# EAGLE schematic AQ32_v2 (EAGLE 7.3.0)
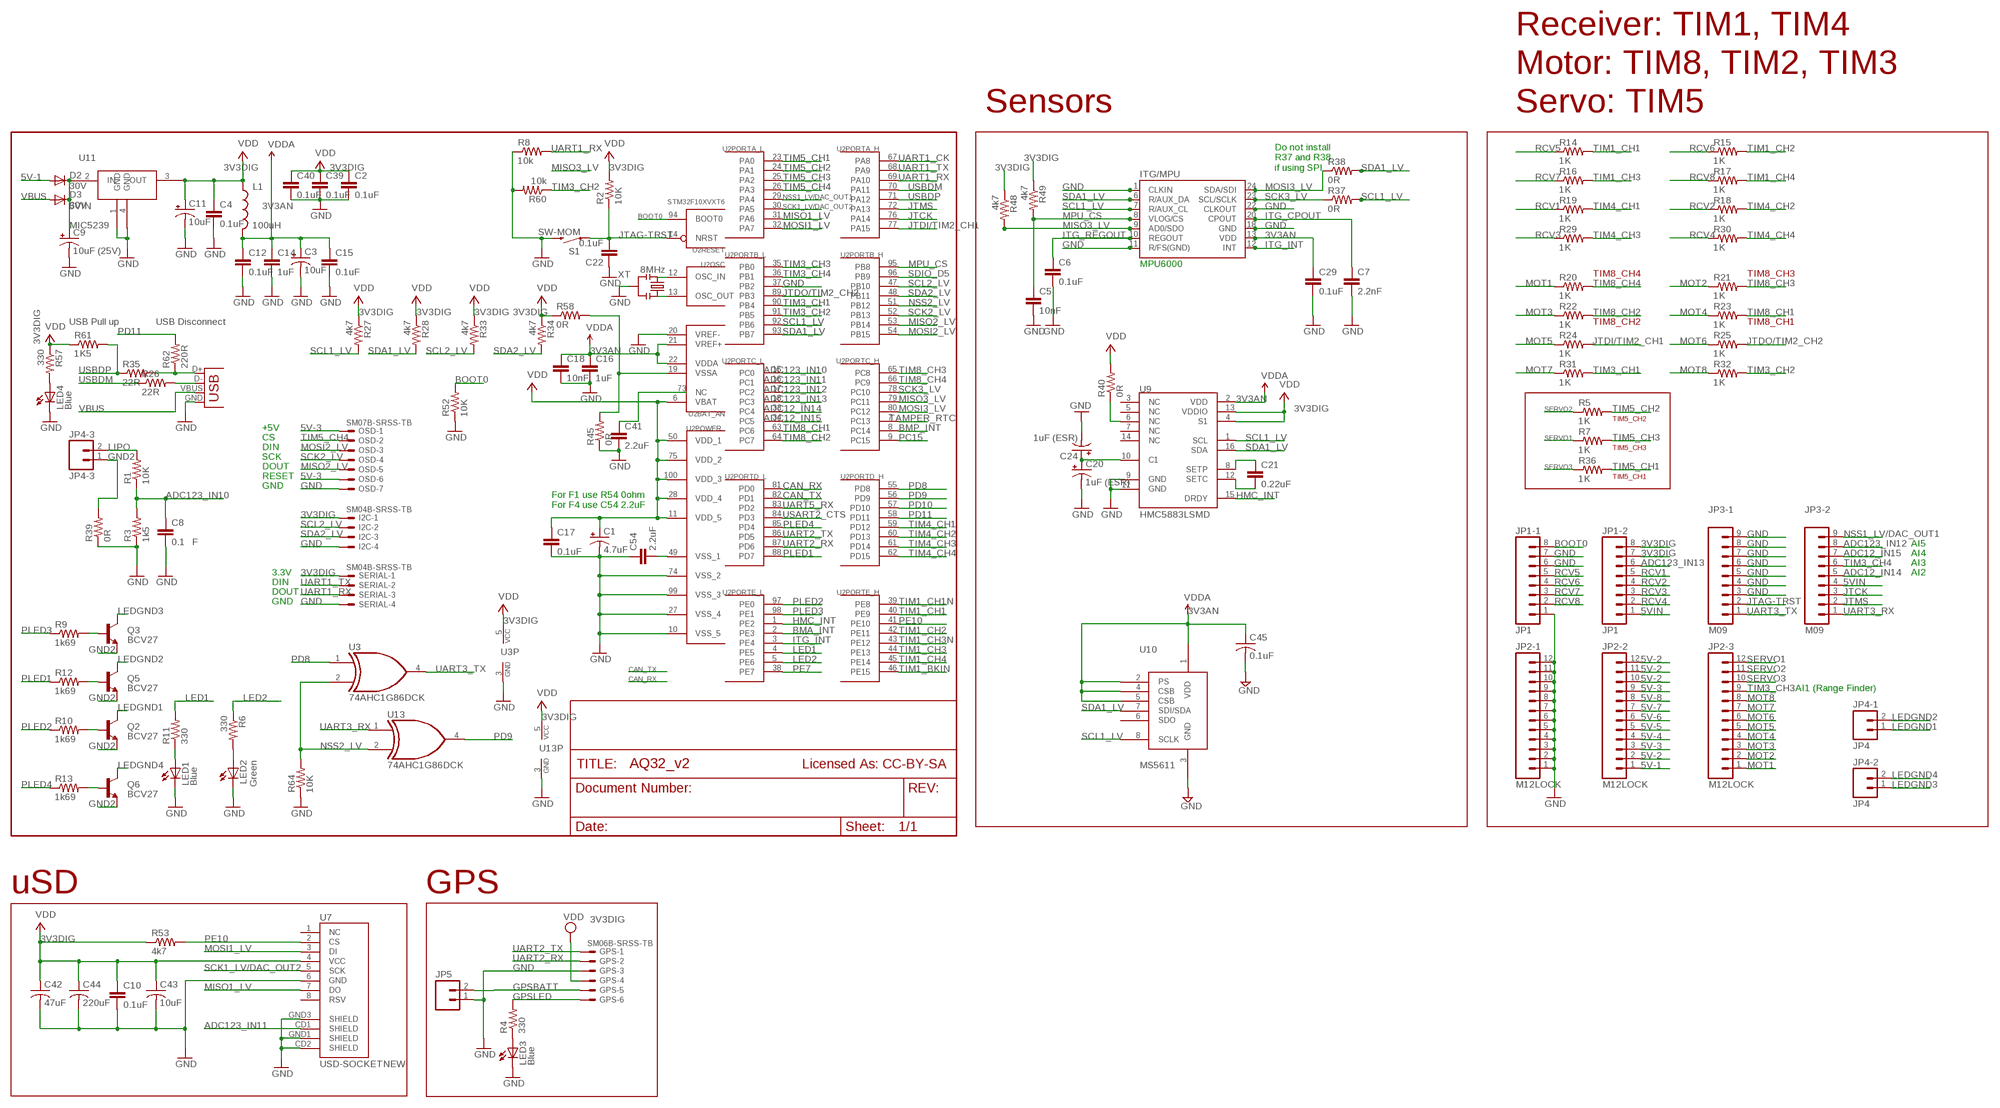
[diagram p0: schematic, sheet 1]

## Parts
C1  4.7uF  CPOL-USSMCZ  [SMC_Z]
C2  0.1uF  CAP0402  [C0402]
C3  10uF  CAP_POL1206  [EIA3216]
C4  0.1uF  CAP0402  [C0402]
C5  10nF  CAP0402  [C0402]
C6  0.1uF  CAP0402  [C0402]
C7  2.2nF  CAP0402  [C0402]
C8  0.1�F  CAP0402  [C0402]
C9  10uF (25V)  CAP_POL1206  [EIA3216]
C10  0.1uF  CAP0402  [C0402]
C11  10uF  CAP_POL1206  [EIA3216]
C12  0.1uF  CAP0402  [C0402]
C14  1uF  CAP0402  [C0402]
C15  0.1uF  CAP0402  [C0402]
C16  1uF  CAP0402  [C0402]
C17  0.1uF  CAP0402  [C0402]
C18  10nF  CAP0402  [C0402]
C20  1uF (ESR)  CPOL-USSMCZ  [SMC_Z]
C21  0.22uF  CAP0402  [C0402]
C22  0.1uF  CAP0402  [C0402]
C24  1uF (ESR)  CPOL-USSMCZ  [SMC_Z]
C29  0.1uF  CAP0402  [C0402]
C39  0.1uF  CAP0402  [C0402]
C40  0.1uF  CAP0402  [C0402]
C41  2.2uF  CAP0402  [C0402]
C42  47uF  C-USC0805  [C0805]
C43  10uF  C-USC0805  [C0805]
C44  220uF  C-USC1206  [C1206]
C45  0.1uF  C-USC0402  [C0402]
C54  2.2uF  CAP0402-CAP  [0402-CAP]
D2  30V  DIODESOD  [SOD-323]
D3  30V  DIODESOD  [SOD-323]
GPS  SM06B-SRSS-TB  [SM06B-SRSS-TB]
I2C  SM04B-SRSS-TB  [SM04B-SRSS-TB]
JP1-1  JP1  M08LOCK  [1X08_LOCK]
JP1-2  JP1  M08LOCK  [1X08_LOCK]
JP2-1  M12LOCK  [1X12_LOCK]
JP2-2  M12LOCK  [1X12_LOCK]
JP2-3  M12LOCK  [1X12_LOCK]
JP3-1  M09  [1X09]
JP3-2  M09  [1X09]
JP4-1  JP4  M02PTH  [1X02]
JP4-2  JP4  M02PTH  [1X02]
JP4-3  JP4-3  M02PTH  [1X02]
JP5  M02PTH  [1X02]
L1  100uH  INDUCTOR0805  [0805]
LED1  Blue  LED0603  [LED-0603]
LED2  Green  LED0603  [LED-0603]
LED3  Blue  LED0603  [LED-0603]
LED4  Blue  LED0603  [LED-0603]
OSD  SM07B-SRSS-TB  [SM07B-SRSS-TB]
Q2  BCV27  TRANSISTOR_NPNSOT23-3  [SOT23-3]
Q3  BCV27  TRANSISTOR_NPNSOT23-3  [SOT23-3]
Q5  BCV27  TRANSISTOR_NPNSOT23-3  [SOT23-3]
Q6  BCV27  TRANSISTOR_NPNSOT23-3  [SOT23-3]
R1  10K  RESISTOR0402  [C0402]
R2  10K  RESISTOR0402  [C0402]
R3  1k5  RESISTOR0402  [C0402]
R4  330  RESISTOR0402  [C0402]
R5  1K  RESISTOR0402  [C0402]
R6  330  RESISTOR0402  [C0402]
R7  1K  RESISTOR0402  [C0402]
R8  10k  R-US_R0402  [R0402]
R9  1k69  RESISTOR0402  [C0402]
R10  1k69  RESISTOR0402  [C0402]
R11  330  RESISTOR0402  [C0402]
R12  1k69  RESISTOR0402  [C0402]
R13  1k69  RESISTOR0402  [C0402]
R14  1K  RESISTOR0402  [C0402]
R15  1K  RESISTOR0402  [C0402]
R16  1K  RESISTOR0402  [C0402]
R17  1K  RESISTOR0402  [C0402]
R18  1K  RESISTOR0402  [C0402]
R19  1K  RESISTOR0402  [C0402]
R20  1K  RESISTOR0402  [C0402]
R21  1K  RESISTOR0402  [C0402]
R22  1K  RESISTOR0402  [C0402]
R23  1K  RESISTOR0402  [C0402]
R24  1K  RESISTOR0402  [C0402]
R25  1K  RESISTOR0402  [C0402]
R26  22R  RESISTOR0402  [C0402]
R27  4k7  RESISTOR0402  [C0402]
R28  4k7  RESISTOR0402  [C0402]
R29  1K  RESISTOR0402  [C0402]
R30  1K  RESISTOR0402  [C0402]
R31  1K  RESISTOR0402  [C0402]
R32  1K  RESISTOR0402  [C0402]
R33  4k7  RESISTOR0402  [C0402]
R34  4k7  RESISTOR0402  [C0402]
R35  22R  RESISTOR0402  [C0402]
R36  1K  RESISTOR0402  [C0402]
R37  0R  R-US_R0402  [R0402]
R38  0R  R-US_R0402  [R0402]
R39  0R  RESISTOR0402  [C0402]
R40  0R  R-US_R0402  [R0402]
R45  0R  R-US_R0402  [R0402]
R48  4k7  RESISTOR0402  [C0402]
R49  4k7  RESISTOR0402  [C0402]
R52  10K  RESISTOR0402  [C0402]
R53  4k7  RESISTOR0402  [C0402]
R57  330  RESISTOR0402  [C0402]
R58  0R  R-US_R0402  [R0402]
R60  10k  R-US_R0402  [R0402]
R61  1K5  R-US_R0402  [R0402]
R62  220R  RESISTOR0402  [C0402]
R64  10K  RESISTOR0402  [C0402]
S1  SW-MOM  SWITCH-MOMENTARY-2SMD  [TACTILE_SWITCH_SMD]
SERIAL  SM04B-SRSS-TB  [SM04B-SRSS-TB]
U1  ITG-3200  [QFN-24]
U2  STM32F10XVXT6  [TQFP100]
U3  74AHC1G86DCK  [SC70-5]
U7  USD-SOCKETNEW  [MICRO-SD-SOCKET-PP]
U9  HMC5883LSMD  [16LPCC]
U10  MS5611  [LGA08A]
U11  MIC5239  [TO-223]
U13  74AHC1G86DCK  [SC70-5]
X2  USBOLD  [USB-MINIB-OLD]
XT  8MHz  RESONATORSMD  [RESONATOR-SMD]

## Nets
3V3AN: C3.A(+) C12.1 C14.1 C15.1 C16.1 C18.1 C29.1 C45.1 L1.2 U1.13(VDD) U2.21(BAT_AN:VREF+) U2.22(BAT_AN:VDDA) U9.2(VDD) U10.1(VDD) U10.2(PS) U10.4(CSB) U10.5(CSB) ; supply symbol labelled VDDA
3V3DIG: C1.+ C2.1 C4.1 C10.1 C11.A(+) C17.1 C39.1 C40.1 C42.1 C43.1 C44.1 GPS.4 I2C.1 JP1-2.7 JP1-2.8 L1.1 R2.2 R27.1 R28.1 R33.1 R34.1 R40.2 R48.1 R49.1 R53.1 R57.1 R58.1 R61.1 SERIAL.1 U2.6(BAT_AN:VBAT) U2.11(POWER:VDD_5) U2.28(POWER:VDD_4) U2.50(POWER:VDD_1) U2.75(POWER:VDD_2) U2.100(POWER:VDD_3) U3.5(VCC) U7.4(VCC) U9.4(S1) U9.13(VDDIO) U11.3(OUT) U13.5(VCC) ; supply symbol labelled VDD
5V-1 [vcc]: D2.2(A) JP2-2.1
5V-2: JP2-2.2 JP2-2.10 JP2-2.11 JP2-2.12
5V-3: JP2-2.3 JP2-2.9 OSD.1 OSD.6
5V-4: JP2-2.4
5V-5: JP2-2.5
5V-6: JP2-2.6
5V-7: JP2-2.7
5V-8: JP2-2.8
5VIN [vcc]: C9.A(+) D2.1(C) D3.1(C) JP1-2.1 JP3-2.4 U11.2(IN)
ADC12_IN14: JP3-2.5 U2.33(PORTC_L:PC4)
ADC12_IN15: JP3-2.7 U2.34(PORTC_L:PC5)
ADC123_IN10: C8.1 R1.1 R3.2 U2.15(PORTC_L:PC0)
ADC123_IN11: U2.16(PORTC_L:PC1) U7.CD1(SHIELD)
ADC123_IN12: JP3-2.8 U2.17(PORTC_L:PC2)
ADC123_IN13: JP1-2.6 U2.18(PORTC_L:PC3)
BMA_INT: U2.2(PORTE_L:PE3)
BMP_INT: U2.8(PORTC_H:PC14)
BOOT0: JP1-1.8 R52.2 U2.94(RESET:BOOT0)
CAN_RX: U2.81(PORTD_L:PD0)
CAN_TX: U2.82(PORTD_L:PD1)
GND [vcc]: C1.- C2.2 C3.C(-) C4.2 C5.2 C6.2 C7.2 C8.2 C9.C(-) C10.2 C11.C(-) C12.2 C14.2 C15.2 C16.2 C17.2 C18.2 C20.- C22.1 C24.- C29.2 C39.2 C40.2 C41.2 C42.2 C43.2 C44.2 C45.2 C54.1 GPS.3 I2C.4 JP1-1.1 JP1-1.6 JP1-1.7 JP2-1.1 JP2-1.2 JP2-1.3 JP2-1.4 JP2-1.5 JP2-1.6 JP2-1.7 JP2-1.8 JP2-1.9 JP2-1.10 JP2-1.11 JP2-1.12 JP3-1.3 JP3-1.4 JP3-1.5 JP3-1.6 JP3-1.7 JP3-1.8 JP3-1.9 JP5.1 LED1.C LED2.C LED3.C LED4.C OSD.7 R3.1 R8.1 R39.1 R45.1 R52.1 R60.2 R64.1 S1.3 SERIAL.4 U1.1(CLKIN) U1.11(R/FS(GND)) U1.18(GND) U1.22(CLKOUT) U2.10(POWER:VSS_5) U2.20(BAT_AN:VREF-) U2.27(POWER:VSS_4) U2.37(PORTB_L:PB2) U2.74(POWER:VSS_2) U2.99(POWER:VSS_3) U3.3(GND) U7.6(GND) U7.CD2(SHIELD) U7.GND1(SHIELD) U7.GND3(SHIELD) U9.9(GND) U9.11(GND) U10.3(GND) U11.1(GND) U11.4(GND) U13.3(GND) X2.GND XT.2
GND2 [vcc]: JP4-3.1 Q2.2(E) Q3.2(E) Q5.2(E) Q6.2(E) R39.2
GPSBATT: GPS.5 JP5.2
GPSLED: GPS.6 R4.2
HMC_INT: U2.1(PORTE_L:PE2) U9.15(DRDY)
ITG_CPOUT: C7.1 U1.20(CPOUT)
ITG_INT: U1.12(INT) U2.3(PORTE_L:PE4)
ITG_REGOUT: C6.1 U1.10(REGOUT)
JTAG-TRST: C22.2 JP3-1.2 R2.1 S1.1 U2.14(RESET:NRST)
JTCK: JP3-2.3 U2.76(PORTA_H:PA14)
JTDI/TIM2_CH1: R24.2 U2.77(PORTA_H:PA15)
JTDO/TIM2_CH2: R25.2 U2.89(PORTB_L:PB3)
JTMS: JP3-2.2 U2.72(PORTA_H:PA13)
LED1: R11.2 U2.4(PORTE_L:PE5)
LED2: R6.1 U2.5(PORTE_L:PE6)
LEDGND1: JP4-1.1 Q2.3(C)
LEDGND2: JP4-1.2 Q5.3(C)
LEDGND3: JP4-2.1 Q3.3(C)
LEDGND4: JP4-2.2 Q6.3(C)
LIPO: JP4-3.2 R1.2
MISO1_LV: U2.31(PORTA_L:PA6) U7.7(DO)
MISO2_LV: OSD.5 U2.53(PORTB_H:PB14)
MISO3_LV: R48.2 U1.9(AD0/SDO) U2.79(PORTC_H:PC11)
MOSI1_LV: U2.32(PORTA_L:PA7) U7.3(DI)
MOSI2_LV: OSD.3 U2.54(PORTB_H:PB15)
MOSI3_LV: R38.1 U1.24(SDA/SDI) U2.80(PORTC_H:PC12)
MOT1: JP2-3.1 R20.1
MOT2: JP2-3.2 R21.1
MOT3: JP2-3.3 R22.1
MOT4: JP2-3.4 R23.1
MOT5: JP2-3.5 R24.1
MOT6: JP2-3.6 R25.1
MOT7: JP2-3.7 R31.1
MOT8: JP2-3.8 R32.1
MPU_CS: C5.1 R49.2 U1.8(VLOG/CS) U2.95(PORTB_H:PB8)
N$1: U2.12(OSC:OSC_IN) XT.3
N$2: U2.13(OSC:OSC_OUT) XT.1
N$3: LED3.A R4.1
N$4: R40.1 U9.6(NC)
N$7: LED2.A R6.2
N$9: Q3.1(B) R9.2
N$10: C54.2 U2.49(POWER:VSS_1)
N$11: Q2.1(B) R10.2
N$12: Q5.1(B) R12.2
N$15: LED1.A R11.1
N$23: Q6.1(B) R13.2
N$28: C41.1 U2.73(BAT_AN:NC)
N$34: LED4.A R57.2
N$36: R45.2 R58.2 U2.19(BAT_AN:VSSA)
N$41: C21.1 U9.8(SETP)
N$42: C21.2 U9.12(SETC)
N$67: C20.+ C24.+ U9.10(C1)
N$72: R35.2 R62.1 X2.D+
N$74: R26.2 X2.D-
NSS1_LV/DAC_OUT1: JP3-2.9 U2.29(PORTA_L:PA4)
NSS2_LV: R64.2 U2.51(PORTB_H:PB12) U3.2(I1) U13.2(I1)
PC15: U2.9(PORTC_H:PC15)
PD8: U2.55(PORTD_H:PD8) U3.1(I0)
PD9: U2.56(PORTD_H:PD9) U13.4(O)
PD10: U2.57(PORTD_H:PD10)
PD11: R62.2 U2.58(PORTD_H:PD11)
PE7: U2.38(PORTE_L:PE7)
PE10: R53.2 U2.41(PORTE_H:PE10) U7.2(CS)
PLED1: R12.1 U2.88(PORTD_L:PD7)
PLED2: R10.1 U2.97(PORTE_L:PE0)
PLED3: R9.1 U2.98(PORTE_L:PE1)
PLED4: R13.1 U2.85(PORTD_L:PD4)
RCV1: JP1-2.5 R19.1
RCV2: JP1-2.4 R18.1
RCV3: JP1-2.3 R29.1
RCV4: JP1-2.2 R30.1
RCV5: JP1-1.5 R14.1
RCV6: JP1-1.4 R15.1
RCV7: JP1-1.3 R16.1
RCV8: JP1-1.2 R17.1
SCK1_LV/DAC_OUT2: U2.30(PORTA_L:PA5) U7.5(SCK)
SCK2_LV: OSD.4 U2.52(PORTB_H:PB13)
SCK3_LV: R37.1 U1.23(SCL/SCLK) U2.78(PORTC_H:PC10)
SCL1_LV: R27.2 R37.2 U1.7(R/AUX_CL) U2.92(PORTB_L:PB6) U9.1(SCL) U10.8(SCLK)
SCL2_LV: I2C.2 R33.2 U2.47(PORTB_H:PB10)
SDA1_LV: R28.2 R38.2 U1.6(R/AUX_DA) U2.93(PORTB_L:PB7) U9.16(SDA) U10.7(SDI/SDA)
SDA2_LV: I2C.3 R34.2 U2.48(PORTB_H:PB11)
SDIO_D5: U2.96(PORTB_H:PB9)
SERVO1: JP2-3.12 R7.1
SERVO2: JP2-3.11 R5.1
SERVO3: JP2-3.10 R36.1
TAMPER_RTC: U2.7(PORTC_H:PC13)
TIM1_BKIN: U2.46(PORTE_H:PE15)
TIM1_CH1: R14.2 U2.40(PORTE_H:PE9)
TIM1_CH1N: U2.39(PORTE_H:PE8)
TIM1_CH2: R15.2 U2.42(PORTE_H:PE11)
TIM1_CH3: R16.2 U2.44(PORTE_H:PE13)
TIM1_CH3N: U2.43(PORTE_H:PE12)
TIM1_CH4: R17.2 U2.45(PORTE_H:PE14)
TIM3_CH1: R31.2 U2.90(PORTB_L:PB4)
TIM3_CH2: R32.2 R60.1 U2.91(PORTB_L:PB5)
TIM3_CH3: JP2-3.9 U2.35(PORTB_L:PB0)
TIM3_CH4: JP3-2.6 U2.36(PORTB_L:PB1)
TIM4_CH1: R19.2 U2.59(PORTD_H:PD12)
TIM4_CH2: R18.2 U2.60(PORTD_H:PD13)
TIM4_CH3: R29.2 U2.61(PORTD_H:PD14)
TIM4_CH4: R30.2 U2.62(PORTD_H:PD15)
TIM5_CH1: R36.2 U2.23(PORTA_L:PA0)
TIM5_CH2: R5.2 U2.24(PORTA_L:PA1)
TIM5_CH3: R7.2 U2.25(PORTA_L:PA2)
TIM5_CH4: OSD.2 U2.26(PORTA_L:PA3)
TIM8_CH1: R23.2 U2.63(PORTC_L:PC6)
TIM8_CH2: R22.2 U2.64(PORTC_L:PC7)
TIM8_CH3: R21.2 U2.65(PORTC_H:PC8)
TIM8_CH4: R20.2 U2.66(PORTC_H:PC9)
UART1_CK: U2.67(PORTA_H:PA8)
UART1_RX: R8.2 SERIAL.3 U2.69(PORTA_H:PA10)
UART1_TX: SERIAL.2 U2.68(PORTA_H:PA9)
UART2_RX: GPS.2 U2.87(PORTD_L:PD6)
UART2_TX: GPS.1 U2.86(PORTD_L:PD5)
UART3_RX: JP3-2.1 U13.1(I0)
UART3_TX: JP3-1.1 U3.4(O)
UART5_RX: U2.83(PORTD_L:PD2)
USART2_CTS: U2.84(PORTD_L:PD3)
USBDM: R26.1 U2.70(PORTA_H:PA11)
USBDP: R35.1 R61.2 U2.71(PORTA_H:PA12)
VBUS: D3.2(A) X2.VBUS
Unconnected: U7.1(NC) U7.8(RSV) U9.3(NC) U9.5(NC) U9.7(NC) U9.14(NC) U10.6(SDO)

## Notes on the sheet
- Receiver: TIM1, TIM4
- Motor: TIM8, TIM2, TIM3
- Sensors | Servo: TIM5
- Do not install
  R37 and R38
  if using SPI
- MPU6000
- TIM8_CH4 | TIM8_CH3
- USB Pull up | USB Disconnect | TIM8_CH2 | TIM8_CH1
- TIM5_CH2
- +5V
- CS
- DIN | TIM5_CH3
- SCK
- DOUT
- RESET | TIM5_CH1
- GND
- For F1 use R54 0ohm
  For F4 use C54 2.2uF
- AI5
- AI4
- AI3
- 3.3V | AI2
- DIN
- DOUT
- GND
- AI1 (Range Finder)
- Licensed As: CC-BY-SA
- uSD | GPS

## Library data of the parts
C1 C20 C24 = rcl:CPOL-US: POLARIZED CAPACITOR, American symbol
C2 C4-C8 C10 C12 C14-C18 C21 C22 C29 C39-C41 = SparkFun:CAP: Capacitor Standard 0603 ceramic capacitor, and 0.1" leaded capacitor.
C3 C9 C11 = SparkFun:CAP_POL: Capacitor Polarized These are standard SMD and PTH capacitors. Normally 10uF, 47uF, and 100uF in electrolytic and tantalum varieties. Always verify the external diameter of the through hole cap, it varies with capacity, voltage, and manufacturer. The EIA devices should be standard.
C42-C45 = rcl:C-US: CAPACITOR, American symbol
C54 = SparkFun-Capacitors:CAP: Capacitor Standard 0603 ceramic capacitor, and 0.1" leaded capacitor.
D2 D3 = SparkFun:DIODE: Diode These are standard reverse protection diodes and small signal diodes. SMA package can handle up to about 1A. SOD-323 can handle about 200mA. What the SOD-323 package when ordering, there are some mfgs out there that are 5-pin packages.
GPS = con-jst2:?M06B-SRSS-TB: Disconnectable Crimp style connector, 1.0mm pitch 6 contacts
I2C SERIAL = con-jst2:?M04B-SRSS-TB: Disconnectable Crimp style connector, 1.0mm pitch 4 contacts
JP1-1 JP1-2 = SparkFun-Connectors:M08: Header 8 Standard 8-pin 0.1" header. Use with straight break away headers (SKU : PRT-00116), right angle break away headers (PRT-00553), swiss pins (PRT-00743), machine pins (PRT-00117), and female headers (PRT-00115).
JP2-1-JP2-3 = SparkFun-Connectors:M12: Header 12 Standard 12-pin 0.1" header. Use with straight break away headers (SKU : PRT-00116), right angle break away headers (PRT-00553), swiss pins (PRT-00743), machine pins (PRT-00117), and female headers (PRT-00115).
JP3-1 JP3-2 = SparkFun-Connectors:M09: Header 9 Standard 9-pin 0.1" header. Use with straight break away headers (SKU : PRT-00116), right angle break away headers (PRT-00553), swiss pins (PRT-00743), machine pins (PRT-00117), and female headers (PRT-00115).
JP4-1-JP4-3 JP5 = SparkFun-Connectors:M02: Header 2 Standard 2-pin 0.1" header. Use with straight break away headers (SKU : PRT-00116), right angle break away headers (PRT-00553), swiss pins (PRT-00743), machine pins (PRT-00117), and female headers (PRT-00115). Molex polarized connector foot print use with SKU : PRT-08233 with associated crimp pins and housings.
L1 = SparkFun:INDUCTOR: Inductors Basic Inductor/Choke - 0603 and 1206. Footprints are not proven and vary greatly between part numbers.
LED1-LED4 = SparkFun:LED: LEDs Standard schematic elements and footprints for 5mm, 3mm, 1206, and 0603 sized LEDs. 5mm - Spark Fun Electronics SKU : COM-00529 (and others)
OSD = con-jst2:?M07B-SRSS-TB: Disconnectable Crimp style connector, 1.0mm pitch 7 contacts
Q2 Q3 Q5 Q6 = SparkFun:TRANSISTOR_NPN: Transistor NPN BJT configuration in SOT23 package. MMBT2222 is the common NPN we use. Double check BCE configuration again layout.
R1-R7 R9-R36 R39 R48 R49 R52 R53 R57 R62 R64 = SparkFun:RESISTOR: Resistor Basic schematic elements and footprints for 0603, 1206, and PTH 1/10th watt (small) resistors.
R8 R60 R61 = rcl:R-US_: RESISTOR, American symbol
R37 R38 R40 R45 R58 = resistor:R-US_: RESISTOR, American symbol
S1 = SparkFun:SWITCH-MOMENTARY-2
U1 = SparkFunMod:ITG-3200: ITG-3200 3-axis gyro, digital output, qfn24 package
U2 = stm32:STM32F10XVXT6: STM32F101/103 100 pin LQFP
U3 U13 = 74xx-little-us:74*1G86: 2-input EXCLUSIV-OR gate
U7 = SparkFun:USD-SOCKET: microSD Socket Push-push type uSD socket. Schematic element and footprint production proven. Spark Fun Electronics SKU : PRT-00127. tDoc lines correctly indicate media card edge positions when inserting (unlocked, locked, depressed).
U9 = SparkFun:HMC5883L: 3 Axis Digital Compass IC
U10 = DSP-TI:MS5611: Pressure sensor 10cm
U11 = DSP-TI:MIC5239: LOD Volt Reg
X2 = SparkFun:USB: USB Connectors USB-B-PTH is fully proven SKU : PRT-00139 USB-miniB is fully proven SKU : PRT-00587 USB-A-PCB is untested. USB-A-H is throughly reviewed, but untested. Spark Fun Electronics SKU : PRT-00437 USB-B-SMT is throughly reviewed, but untested. Needs silkscreen touching up. USB-A-S has not been used/tested USB-MB-H has not been used/tested
XT = SparkFun:RESONATOR: Resonator Small SMD resonator. This is the itty bitty 10/20MHz resonators with built in caps. CSTCE10M0G55 and CSTCE20M0V53. Footprint has been reviewed closely but hasn't been tested yet.

## Net classes
0 default: width 0.203 mm
1 vcc: width 0.254 mm